# Altium project PCB_Project_sch_layout.PrjPcb (part 1 of 2)
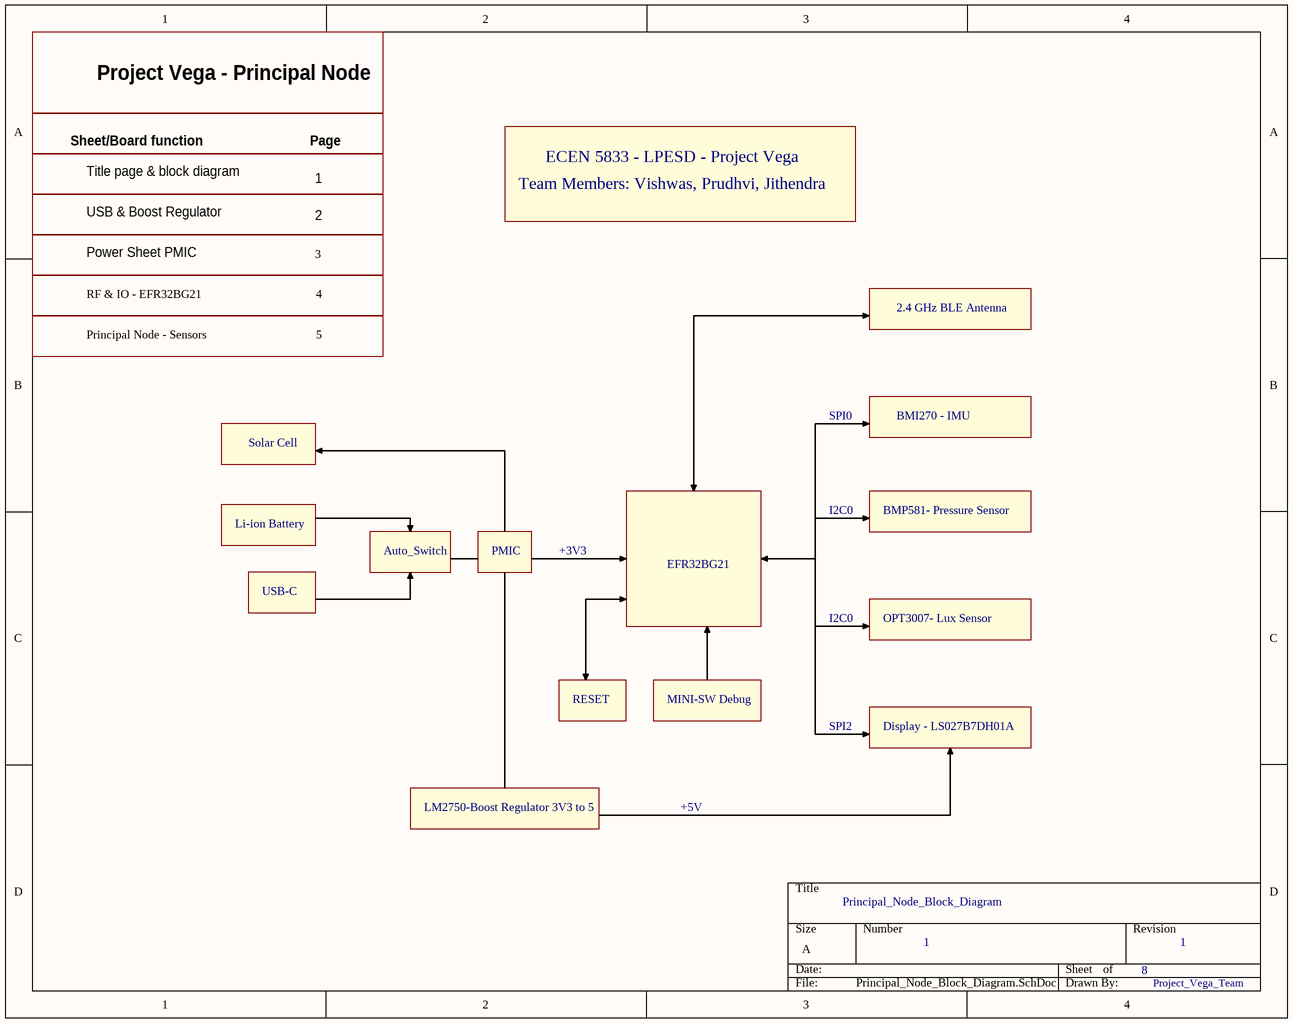
[diagram p0: Principal_Node_Block_Diagram.SchDoc]
8 sheets, 154 parts. Net scope: flat (ports and power ports of the same name join across sheets).
Board file: PCB_Vega.PcbDoc
Sheets:
  Principal_Node_Block_Diagram.SchDoc
  Input_power.SchDoc
  Power_Sheet.SchDoc
  Principal_Node.SchDoc
  Project_Node_Sensors.SchDoc
  Client_Node_Block_Diagram.SchDoc
  Client_Node_1.SchDoc
  Client_Node_2.SchDoc

## Sheet Principal_Node_Block_Diagram.SchDoc: Principal_Node_Block_Diagram
size A; DrawnBy: Project_Vega_Team; Revision: 1; SheetNumber: 1; SheetTotal: 8

### Notes on the sheet
- Project Vega - Principal Node
- Sheet/Board function
- Page
- ECEN 5833 - LPESD - Project Vega
- Title page & block diagram
- USB & Boost Regulator
- 1
- 2
- Team Members: Vishwas, Prudhvi, Jithendra
- Power Sheet PMIC
- RF & IO - EFR32BG21
- 3
- 4
- Principal Node - Sensors
- 5
- 2.4 GHz BLE Antenna
- SPI0
- BMI270 - IMU
- Solar Cell
- Li-ion Battery
- Auto_Switch
- PMIC
- +3V3
- EFR32BG21
- I2C0
- BMP581- Pressure Sensor
- USB-C
- OPT3007- Lux Sensor
- RESET
- MINI-SW Debug
- SPI2
- Display - LS027B7DH01A
- LM2750-Boost Regulator 3V3 to 5
- +5V

## Sheet Input_power.SchDoc: Input_Power
size A4; DrawnBy: Project_Vega_Team; Revision: 1; SheetNumber: 2; SheetTotal: 7
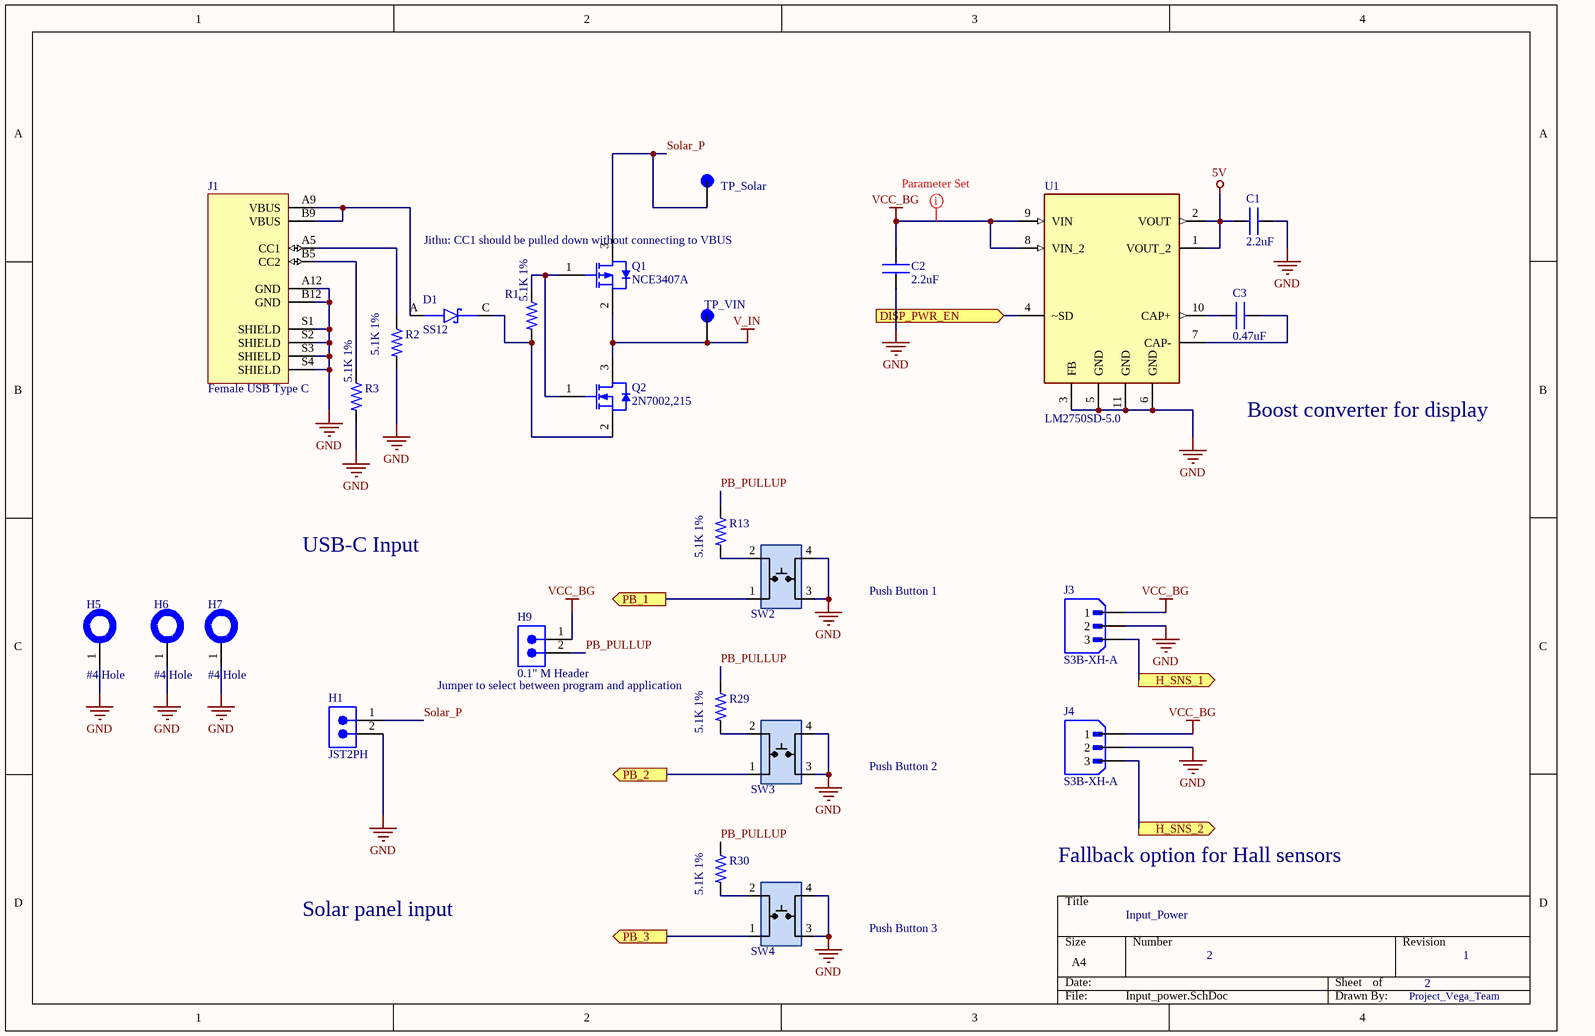
[diagram p1: Input_power.SchDoc]

### Parts
C1  2.2uF  [CAP_0603_1MM]
C2  2.2uF  [CAP_0603_1MM]
C3  0.47uF  [CAP_0603_1MM]
D1  SS12  [DIOM4427X270N]
H1  JST2PH  [JST_B2B-PH-K-S(LF)(SN)]
H5  #4 Hole  [HOLE_#4]  (no BOM)
H6  #4 Hole  [HOLE_#4]  (no BOM)
H7  #4 Hole  [HOLE_#4]  (no BOM)
H9  0.1" M Header  [2-PIN_MALE_HEADER_01-IN]
J1  Female USB Type C  [GCT_USB4125-GF-A_REVA2]
J3  S3B-XH-A  [JST_S3B-XH-A]
J4  S3B-XH-A  [JST_S3B-XH-A]
Q1  NCE3407A  [NCEP-SOT23-3_M]
Q2  2N7002,215  [NXP-SOT23-3_V]
R1  5.1K 1%  [RES_0603_1608X06]
R2  5.1K 1%  [RES_0603_1608X06]
R3  5.1K 1%  [RES_0603_1608X06]
R13  5.1K 1%  [RES_0603]
R29  5.1K 1%  [RES_0603]
R30  5.1K 1%  [RES_0603]
SW2  TL3305AF160QG  [Switch_JLC]  (value not drawn)
SW3  TL3305AF160QG  [Switch_JLC]  (value not drawn)
SW4  TL3305AF160QG  [Switch_JLC]  (value not drawn)
TP_Solar  Test_point  [1]  (value not drawn)
TP_VIN  Test_point  [1]  (value not drawn)
U1  LM2750SD-5.0  [LM2750_DFN300X300X80-11N]

### Ports
DISP_PWR_EN (in, see Principal_Node[2D]), H_SNS_1 (out, see Principal_Node[2D]), H_SNS_2 (out, see Principal_Node[2D]), PB_1 (out, see Principal_Node[2C]), PB_2 (out, see Principal_Node[2C]), PB_3 (out, see Principal_Node[2D])

### Nets
5V: C1.2 U1.1(VOUT_2) U1.2(VOUT)
GND: C1.1 C2.1 H1.2 H5.1 H6.1 H7.1 J1.A12(GND) J1.B12(GND) J1.S1(SHIELD) J1.S2(SHIELD) J1.S3(SHIELD) J1.S4(SHIELD) J3.2 J4.2 R2.2 R3.2 SW2.3 SW2.4 SW3.3 SW3.4 SW4.3 SW4.4 U1.3(FB) U1.5(GND) U1.6(GND) U1.11(GND)
V_IN: Q1.2(SOURCE) Q2.3(D) TP_VIN.TP(VIN)
VCC_BG: C2.2 H9.1 J3.1 J4.1 U1.8(VIN_2) U1.9(VIN)
PB_PULLUP: H9.2 R13.1 R29.1 R30.1
Solar_P: H1.1 Q1.3(DRAIN) TP_Solar.TP(Solar)
NetC3_1: C3.1 U1.7(CAP-)
NetC3_2: C3.2 U1.10(CAP+)
NetD1_A: D1.A J1.A9(VBUS) J1.B9(VBUS)
NetD1_C: D1.C Q2.2(S) R1.2
NetJ1_A5: J1.A5(CC1) R2.1
NetJ1_B5: J1.B5(CC2) R3.1
NetJ3_3: J3.3 ; port H_SNS_1
NetJ4_3: J4.3 ; port H_SNS_2
NetQ1_1: Q1.1(GATE) Q2.1(G) R1.1
NetR13_2: R13.2 SW2.2
NetR29_2: R29.2 SW3.2
NetR30_2: R30.2 SW4.2
NetR33_2: SW3.1 ; port PB_2
NetR36_2: SW2.1 ; port PB_1
NetSW4_1: SW4.1 ; port PB_3
NetU1_4: U1.4(~SD) ; port DISP_PWR_EN

### Layout directives
rule Width Constraint [Pref Width = 20mil    Min Width = 6mil    Max Width = 20mil]: VCC_BG

### Notes on the sheet
- (near Q1) Jithu: CC1 should be pulled down without connecting to VBUS
- Boost converter for display
- USB-C Input
- Push Button 1
- (near R29) Jumper to select between program and application
- Push Button 2
- Solar panel input
- Fallback option for Hall sensors
- Push Button 3

### Library data of the parts
C1 = GRM188R61A226ME15D: Manufacturer: Murata; Capacitance: 22 uF; Voltage Rating DC: 10 VDC; Dielectric: X5R; Tolerance: 20 %; Brand: Murata Electronics; Type: Voltage and Temperature Derating Recommended Product; Unit Weight: 0.000222 oz; Supplier 1: Digi-Key; Supplier Part Number 1: 490-10476-1-ND; Manufacturer Part Number: GRM188R61A226ME15D; Stock 1: 849458; Pricing 1: 1=0.33, 10=0.226, 50=0.1506, 100=0.1279, 500=0.0903, 1000=0.079 (USD); Product Category: Multilayer Ceramic Capacitors MLCC - SMD/SMT; RoHS: True; Case Code - in: 0603; Case Code - mm: 1608; Height: 0.8 mm; Maximum Operating Temperature: + 85 C; Minimum Operating Temperature: - 55 C; Product: General Type MLCCs; Series: GRM; Packaging: Reel; Length: 1.6 mm; Package / Case: 0603 (1608 metric); Factory Pack Quantity: 4000; Termination Style: SMD/SMT; Width: 0.8 mm; ComponentLink1URL: http://www.farnell.com/datasheets/2047978.pdf?src-supplier=Element14; ComponentLink1Description: http://www.farnell.com/datasheets/2047978.pdf?src-supplier=Element14
C2 C3 = GRM188R61A226ME15D: CAP CER 22UF 10V X5R 0603; Manufacturer: Murata; Voltage Rating DC: 10 VDC; Tolerance: 20 %; Brand: Murata Electronics; Type: Voltage and Temperature Derating Recommended Product; Unit Weight: 0.000222 oz; Supplier 1: Digi-Key; Supplier Part Number 1: 490-10476-1-ND; Manufacturer Part Number: GRM188R61A226ME15D; Stock 1: 849458; Pricing 1: 1=0.33, 10=0.226, 50=0.1506, 100=0.1279, 500=0.0903, 1000=0.079 (USD); Product Category: Multilayer Ceramic Capacitors MLCC - SMD/SMT; RoHS: True; Capacitance: 22 uF; Dielectric: X5R; Case Code - in: 0603; Case Code - mm: 1608; Height: 0.8 mm; Maximum Operating Temperature: + 85 C; Minimum Operating Temperature: - 55 C; Product: General Type MLCCs; Series: GRM; Packaging: Reel; Length: 1.6 mm; Package / Case: 0603 (1608 metric); Factory Pack Quantity: 4000; Termination Style: SMD/SMT; Width: 0.8 mm; ComponentLink1URL: http://www.farnell.com/datasheets/2047978.pdf?src-supplier=Element14; ComponentLink1Description: http://www.farnell.com/datasheets/2047978.pdf?src-supplier=Element14
D1 = SS12: DIODE SCHOTTKY 20V 1A DO214AC; MF: Klein Tools,; SnapEDA_Link: https://www.snapeda.com/parts/SS12/Klein%20Tools,%20Inc./view-part/2177644/?ref=snap; MP: SS12; Check_prices: https://www.snapeda.com/parts/SS12/Klein%20Tools,%20Inc./view-part/2177644/?ref=eda; Price: None; Purchase-URL: https://pricing.snapeda.com/search/part/SS12/?ref=eda; Value: *; Availability: Good; Package: DO-214AC-214 ON Semiconductor; ComponentLink1Description: digikey; ComponentLink1URL: https://www.digikey.com/en/products/detail/onsemi/SS12/1049858
H1 = JST2PH: Connector Header Through Hole 2 position 0.079" (2.00mm); Manufacturer: JST; Manufacturer Part Number: B2B-PH-K-S; Supplier: Digi-Key; Supplier Part Number: 455-1704-ND; RoHS: Yes; Category: Connectors; Stock: 1077617; Pricing: 1=0.19, 10=0.147, 100=0.1088, 500=0.09006, 1000=0.0788, 5000=0.06754, 10000=0.06567 (USD); ComponentLink1URL: https://datasheet.ciiva.com/6905/phseries-6905929.pdf?src-supplier=Digi-Key; ComponentLink1Description: https://datasheet.ciiva.com/6905/phseries-6905929.pdf?src-supplier=Digi-Key
H5-H7 = HOLE_#4
H9 = PRPC002SAAN-RC: CONN HEADER VERT 2POS 2.54MM; Manufacturer: Sullins; Connector Type: Header, Unshrouded, Breakaway; Number of Positions: 2; Number of Positions Loaded: All; Pitch: 0.100" (2.54mm); Online Catalog: 0.100" (2.54mm) Pitch Connector Headers; Other Names: S9510E-02  S9510E-02-ND; Supplier 1: Digi-Key; Manufacturer Part Number: PRPC002SAAN-RC; Stock 1: 42739; Pricing 1: 1=0.08, 10=0.073, 25=0.054, 50=0.0464, 100=0.0449, 250=0.0387, 500=0.0372 (USD); Standard Package: 1; Category: Connectors, Interconnects; Family: Rectangular Connectors - Headers, Male Pins; Series: -; Packaging: Bulk; Contact Type: Male Pin; Number of Rows: 1; Row Spacing: -; Contact Mating Length: 0.230" (5.84mm); Mounting Type: Through Hole; Termination: Solder; Fastening Type: -; Features: -; Contact Finish: Gold; Contact Finish Thickness: Flash; Color: Black; ComponentLink1URL: https://media.digikey.com/PDF/Data%20Sheets/Sullins%20PDFs/xRxCzzzSxxN-RC_ST_11635-B.pdf?src-supplier=Digi-Key; ComponentLink1Description: https://media.digikey.com/PDF/Data%20Sheets/Sullins%20PDFs/xRxCzzzSxxN-RC_ST_11635-B.pdf?src-supplier=Digi-Key; Supplier Part Number 1: S1011EC-02-ND
J1 = USB-C Power Connector: USB Connector, 24 Contact(s), Female, Right Angle, Solder Terminal, Locking, Receptacle; Manufacturer Part Number: USB4125-GF-A_REVA2; Manufacturer: Global Connector Technology; Package: None; Availability: Unavailable; Value: *; Price: None; Supplier: Digikey; Supplier Part Number: 2073-USB4125-GF-ACT-ND; RoHS: No; Category: Connectors; Stock: 9026; Pricing: 1=0.8, 10=0.609, 25=0.5472, 50=0.505, 100=0.4667, 250=0.42128, 500=0.3905, 1000=0.36254, 2000=0.3372, 3000=0.32348, 5000=0.3073, 7000=0.29727, 10000=0.28716, 25000=0.2675 (USD); Pins: 6; Gender: Receptacle; Orientation: Horizontal; ComponentLink1URL: https://datasheet.octopart.com/USB4125-GF-A-Global-Connector-Technology-datasheet-148864632.pdf?src-supplier=Future+Electronics; ComponentLink1Description: https://datasheet.octopart.com/USB4125-GF-A-Global-Connector-Technology-datasheet-148864632.pdf?src-supplier=Future+Electronics; ComponentLink2URL: https://datasheet.octopart.com/USB4125-GF-A-GCT-datasheet-166929326.pdf?src-supplier=SOS+electronic; ComponentLink2Description: https://datasheet.octopart.com/USB4125-GF-A-GCT-datasheet-166929326.pdf?src-supplier=SOS+electronic
J3 J4 = S3B-XH-A: Board Connector, 3 Contact(s), 1 Row(s), Male, Right Angle, Solder Terminal; Manufacturer: JST; MF: JST Sales; MP: B3B-XH-A(LF)(SN); Number of Contacts: 3; SnapEDA_Link: https://www.snapeda.com/parts/B3B-XH-A(LF)(SN)/JST+Sales+America+Inc./view-part/?ref=snap; Package: None; Value: *; Check_prices: https://www.snapeda.com/parts/B3B-XH-A(LF)(SN)/JST+Sales+America+Inc./view-part/?ref=eda; Supplier 1: Digikey; Supplier Part Number 1: 455-S3B-XH-A-ND; Supplier: Digikey; Supplier Part Number: 455-S3B-XH-A-ND; Manufacturer Part Number: S3B-XH-A; RoHS: Yes; Category: FFC / FPC; Stock: 168930; Pricing: 1=0.19, 10=0.146, 100=0.1118, 500=0.09304, 1000=0.08614, 5000=0.07248, 10000=0.06971 (USD); Contact Plating: Tin; Contact Material: Brass; Number of Rows: 1; Termination: Through Hole; Gender: Male; Series: XH; Reach SVHC Compliant: No; ComponentLink1URL: https://datasheet.ciiva.com/8052/621903-8052222.pdf?src-supplier=Element14; ComponentLink1Description: https://datasheet.ciiva.com/8052/621903-8052222.pdf?src-supplier=Element14
Q1 = CMP-013-00018-3: P-Channel Enhancement Mode Power MOSFET, 30 V, 4.3 A, - 55 to 150 degC, 3-Pin SOT23, RoHS, Tape and Reel; Manufacturer: NCE Power; Datasheet Version: Rev. 1.1, 07/2014; Case/Package: SOT23-3; Mounting Technology: SM; Datasheet URL: http://www.ncepower.com/Upload/MOSFET/mos1/55vpmos/NCE3407Adatasheet-17275285683.pdf; Package Reference: SOT23-3; Package Description: 3-Pin Small Outline Transistor, Body 2.9 x 1.3 mm, Pitch 0.95 mm; RoHS Compliant: Unknown
Q2 = CMP-013-00011-4: N-channel Trench MOSFET, 60 V, 300 mA, -65 to 150 degC, 3-Pin SOT-23 (TO-236AB), RoHS, Tape and Reel; Manufacturer: NXP Semiconductors; Elements: 1; Power: 830mW; Max Dual Supply Voltage: 60V; Rds On Max: 5Ohm; Package Version: Feb-16; Nominal Vgs: 2V; Input Capacitance: 50pF; RoHS Compliant: True; Datasheet URL: http://www.nxp.com/documents/data_sheet/2N7002.pdf; Packaging: TapeandReel; Case/Package: TO-236-3; Package Reference: SOT23-3; Max Operating Temperature: 150°C; Pins: 8; Mounting Technology: SM; Package Quantity: 1; Datasheet Version: Rev. 7, 09/2011; Nominal Dual Supply Voltage: 60V; Min Operating Temperature: -65°C; Package Description: 3-Pin Small Outline Transistor, Body 1.3 x 2.9 mm, Pitch 0.95 mm; Vds Max: 60V
R1 R3 R13 R29 R30 = RC0603FR-07316KL: SMD Chip Resistor, 5.1KOhm, ± 1%, 100 mW, 0603 [1608 Metric], Thick Film, General Purpose; Manufacturer: Yageo; Value: 316kR; Power Rating: 100mW; Voltage Rating: 50V; Temperature Coefficient: 100ppm/°C; Supplier: Digikey; Supplier Part Number: 311-316KHRCT-ND; Manufacturer Part Number: RC0603FR-07316KL; RoHS: Yes; Category: Chip SMD Resistors; Stock: 149463; Pricing: 1=0.1, 10=0.019, 50=0.0112, 100=0.0093, 500=0.00622, 1000=0.00532 (USD); Mounting Technology: Surface Mount; Case/Package: 0603; Case Code (Imperial): 0603; Case Code (Metric): 1608; Min Operating Temperature: -55°C; Max Operating Temperature: 155°C; Tolerance: 1%; Packaging: Tape and Reel; Termination: SMD/SMT; Number of Terminations: 2; Max Power Dissipation: 100mW; Voltage Rating (DC): 50V; Features: Moisture Resistant; Series: RC; Lead Free: Lead Free; RoHS Compliant: Yes; ComponentLink1URL: https://datasheet.ciiva.com/2454/pyu-r-int-thick-7-2454966.pdf?src-supplier=Digikey; ComponentLink1Description: https://datasheet.ciiva.com/2454/pyu-r-int-thick-7-2454966.pdf?src-supplier=Digikey; ComponentLink2URL: https://datasheet.ciiva.com/2454/pyu-r-int-thick-7-2454967.pdf?src-supplier=Digikey; ComponentLink2Description: https://datasheet.ciiva.com/2454/pyu-r-int-thick-7-2454967.pdf?src-supplier=Digikey; ComponentLink3URL: https://datasheet.ciiva.com/2454/pyu-r-int-thick-7-2454968.pdf?src-supplier=Digikey; ComponentLink3Description: https://datasheet.ciiva.com/2454/pyu-r-int-thick-7-2454968.pdf?src-supplier=Digikey
R2 = RC0603FR-07316KL: SMD Chip Resistor, 316 kOhm, ± 1%, 100 mW, 0603 [1608 Metric], Thick Film, General Purpose; Manufacturer: Yageo; Value: 316kR; Power Rating: 100mW; Voltage Rating: 50V; Temperature Coefficient: 100ppm/°C; Supplier: Digikey; Supplier Part Number: 311-316KHRCT-ND; Manufacturer Part Number: RC0603FR-07316KL; RoHS: Yes; Category: Chip SMD Resistors; Stock: 149463; Pricing: 1=0.1, 10=0.019, 50=0.0112, 100=0.0093, 500=0.00622, 1000=0.00532 (USD); Mounting Technology: Surface Mount; Case/Package: 0603; Case Code (Imperial): 0603; Case Code (Metric): 1608; Min Operating Temperature: -55°C; Max Operating Temperature: 155°C; Tolerance: 1%; Packaging: Tape and Reel; Termination: SMD/SMT; Number of Terminations: 2; Max Power Dissipation: 100mW; Voltage Rating (DC): 50V; Features: Moisture Resistant; Series: RC; Lead Free: Lead Free; RoHS Compliant: Yes; ComponentLink1URL: https://datasheet.ciiva.com/2454/pyu-r-int-thick-7-2454966.pdf?src-supplier=Digikey; ComponentLink1Description: https://datasheet.ciiva.com/2454/pyu-r-int-thick-7-2454966.pdf?src-supplier=Digikey; ComponentLink2URL: https://datasheet.ciiva.com/2454/pyu-r-int-thick-7-2454967.pdf?src-supplier=Digikey; ComponentLink2Description: https://datasheet.ciiva.com/2454/pyu-r-int-thick-7-2454967.pdf?src-supplier=Digikey; ComponentLink3URL: https://datasheet.ciiva.com/2454/pyu-r-int-thick-7-2454968.pdf?src-supplier=Digikey; ComponentLink3Description: https://datasheet.ciiva.com/2454/pyu-r-int-thick-7-2454968.pdf?src-supplier=Digikey
SW2-SW4 = SW_Push_Button_JLC: Tactile Switch SPST-NO Top Actuated Surface Mount; MFR Part #: KH-4.5X4.5X4.3H-STM; LCSC Part#: C2837550; Type: Extended; DataSheet: https://datasheet.lcsc.com/lcsc/2106081532_Shenzhen-Kinghelm-Elec-KH-4.5X4.5X4.3H-STM_C2837550.pdf
TP_Solar TP_VIN = Test_point: SMT Test Point- Mininature-1000 pc Reels; MP: 5019; MF: Keystone Electronics; Value: *; Availability: In Stock; Purchase-URL: https://pricing.snapeda.com/search/part/5019/?ref=eda; Package: None; Price: None
U1 = LM2750SD-5.0: Voltage Regulators - Switching Regulators Reg Switch Capacitor Boost Reg; Manufacturer: TI National Semiconductor; Manufacturer Part Number: LM2750SD-5.0/NOPB; MP: LM2750SD-5-0; Output Voltage: 5V; Number of Outputs: 1; Output Current: 120mA; Frequency: 1.7MHz; Max Supply Voltage: 5.6V; Min Supply Voltage: 2.7V; Efficiency: 87%; Operating Supply Current: 5mA; Min Output Voltage: 4.8V; Output Type: Fixed; Package: None; Price: None; Value: *; Availability: Unavailable; Supplier 1: Digikey; Supplier Part Number 1: LM2750SD-5.0/NOPBCT-ND; Supplier: Digikey; Supplier Part Number: LM2750SD-5.0/NOPBCT-ND; RoHS: Yes; Category: Voltage Regulators - Switching; Stock: 1468; Pricing: 1=2.34, 10=1.674, 25=1.5068, 100=1.3227, 250=1.23504, 500=1.18214 (USD); Mounting Technology: Surface Mount; Pins: 10; Min Operating Temperature: -40°C; Max Operating Temperature: 85°C; Packaging: Tape and Reel; Max Output current: 120mA; Min Input Voltage: 2.7V; Switching Frequency: 1.7MHz; Nominal Output Voltage: 5V; Max Output Voltage: 5V; Termination: SMD/SMT; Quiescent Current: 5mA; Topology: Boost; Series: LM2750; Length: 3mm; Width: 3mm; Height: 0.8mm; Thickness: 750um; Radiation Hardening: No; Reach SVHC Compliant: No; Lead Free: Lead Free; RoHS Compliant: Yes; ComponentLink1URL: https://datasheet.ciiva.com/5699/1781827-5699312.pdf?src-supplier=Farnell; ComponentLink1Description: https://datasheet.ciiva.com/5699/1781827-5699312.pdf?src-supplier=Farnell; ComponentLink2URL: https://datasheet.ciiva.com/6598/lm2750-6598374.pdf?src-supplier=Digikey; ComponentLink2Description: https://datasheet.ciiva.com/6598/lm2750-6598374.pdf?src-supplier=Digikey; ComponentLink3URL: https://datasheet.ciiva.com/7994/59930-7994364.pdf?src-supplier=Element14; ComponentLink3Description: https://datasheet.ciiva.com/7994/59930-7994364.pdf?src-supplier=Element14

## Sheet Power_Sheet.SchDoc: Power Sheet
size A4; DrawnBy: Project_Vega_Team; Revision: 1; SheetNumber: 3; SheetTotal: 7
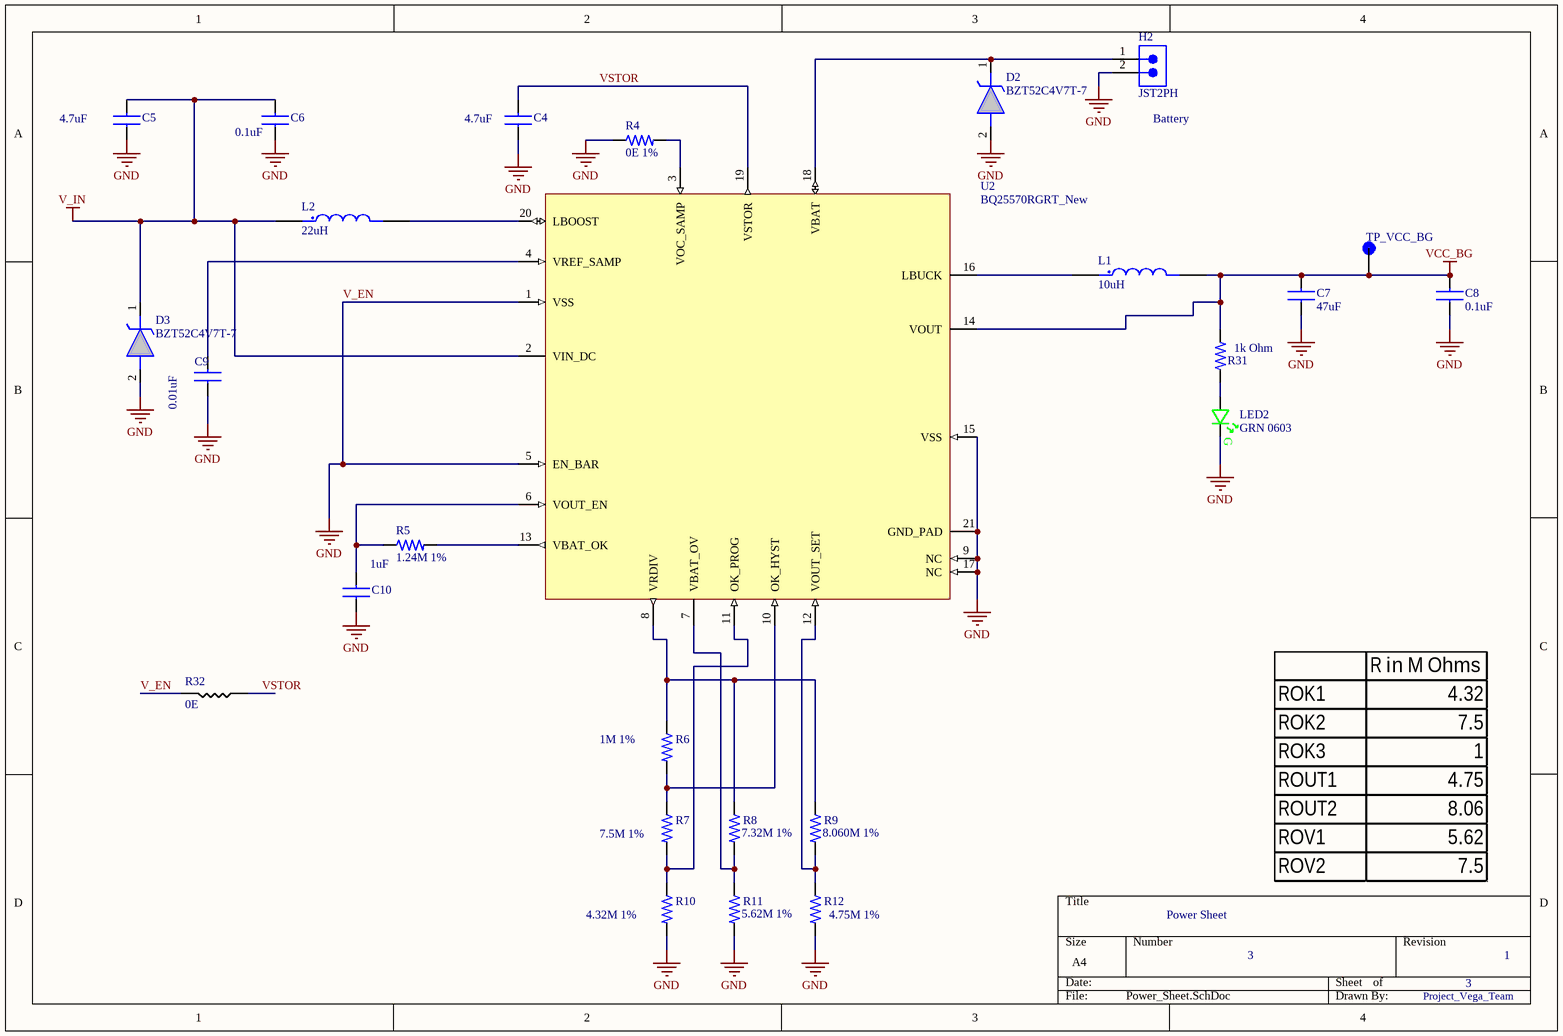
[diagram p2: Power_Sheet.SchDoc]

### Parts
C4  4.7uF  [CAP_0603_1MM]
C5  4.7uF  [CAP_0603_1MM]
C6  0.1uF  [CAP_0603_1MM]
C7  47uF  [CAP_0603_1MM]
C8  0.1uF  [CAP_0603_1MM]
C9  0.01uF  [CAP_0603_1MM]
C10  1uF  [CAP_0603_1MM]
D2  BZT52C4V7T-7  [SOD3715X135N]
D3  BZT52C4V7T-7  [SOD3715X135N]
H2  JST2PH  [JST_B2B-PH-K-S(LF)(SN)]
L1  10uH  [IND_LPS4018-103MRB]
L2  22uH  [IND_LPS4018-223MRC]
LED2  GRN 0603  [LED_0603_GRN_WL-SMCW]
R4  0E 1%  [RES_0603_1608X06]
R5  1.24M 1%  [RES_0603_1608X06]
R6  1M 1%  [RES_0603_1608X06]
R7  7.5M 1%  [RES_0603_1608X06]
R8  7.32M 1%  [RES_0603_1608X06]
R9  8.060M 1%  [RES_0603_1608X06]
R10  4.32M 1%  [RES_0603_1608X06]
R11  5.62M 1%  [RES_0603_1608X06]
R12  4.75M 1%  [RES_0603_1608X06]
R31  1k Ohm  [RES_0603]
R32  value 0E  [1206_Passive_Resitor]  (hidden comment: 10k)
TP_VCC_BG  Test_point  [1]  (value not drawn)
U2  BQ25570RGRT_New  [QFN50P350X350X100-21N - duplicate]

### Nets
GND: C4.1 C5.1 C6.1 C7.1 C8.1 C9.1 C10.1 D2.2(A) D3.2(A) H2.2 LED2.C R4.1 R10.2 R11.2 R12.2 R32.2 U2.1(VSS) U2.5(EN_BAR) U2.9(NC) U2.15(VSS) U2.17(NC) U2.21(GND_PAD)  [also labelled V_EN]
V_IN: C5.2 C6.2 D3.1(K) L2.1 U2.2(VIN_DC)
VCC_BG: C7.2 C8.2 L1.2 R31.2 TP_VCC_BG.TP(VCC_BG) U2.14(VOUT)
VSTOR: C4.2 R32.1 U2.19(VSTOR)
NetC9_2: C9.2 U2.4(VREF_SAMP)
NetC10_2: C10.2 R5.1 U2.6(VOUT_EN)
NetD2_1: D2.1(K) H2.1 U2.18(VBAT)
NetL1_1: L1.1 U2.16(LBUCK)
NetL2_2: L2.2 U2.20(LBOOST)
NetLED2_A: LED2.A R31.1
NetR4_2: R4.2 U2.3(VOC_SAMP)
NetR5_2: R5.2 U2.13(VBAT_OK)
NetR6_1: R6.1 R8.1 R9.1 U2.8(VRDIV)
NetR6_2: R6.2 R7.1 U2.10(OK_HYST)
NetR7_2: R7.2 R10.1 U2.11(OK_PROG)
NetR8_2: R8.2 R11.1 U2.7(VBAT_OV)
NetR9_2: R9.2 R12.1 U2.12(VOUT_SET)

### Notes on the sheet
- (near H2) Battery
- (in symbol LED_green) G

### Library data of the parts
C4-C10 = GRM188R61A226ME15D: as C2 on sheet Input_power; Supplier 1: Digi-Key; Supplier Part Number 1: 490-10476-1-ND; Manufacturer Part Number: GRM188R61A226ME15D; Stock 1: 849458; Pricing 1: 1=0.33, 10=0.226, 50=0.1506, 100=0.1279, 500=0.0903, 1000=0.079 (USD); Product Category: Multilayer Ceramic Capacitors MLCC - SMD/SMT; RoHS: True; Capacitance: 22 uF; Dielectric: X5R; Case Code - in: 0603; Case Code - mm: 1608; Height: 0.8 mm; Maximum Operating Temperature: + 85 C; Minimum Operating Temperature: - 55 C; Product: General Type MLCCs; Series: GRM; Packaging: Reel; Length: 1.6 mm; Package / Case: 0603 (1608 metric); Factory Pack Quantity: 4000; Termination Style: SMD/SMT; Width: 0.8 mm; ComponentLink1URL: http://www.farnell.com/datasheets/2047978.pdf?src-supplier=Element14; ComponentLink1Description: http://www.farnell.com/datasheets/2047978.pdf?src-supplier=Element14
D2 D3 = BZT52C4V7T-7: Diode Zener Single 4.7V 6% 300mW 2-Pin SOD-523 T/R; Manufacturer_Name: Diodes Incorporated; Manufacturer: Diodes; Geometry.Height: 0.65mm; Impedance: 80R; Max Reverse Leakage Current: 3uA; Zener Current: 5mA; ESD Protection: No; Mouser Part Number: 621-BZT52C4V7T-7; Mouser Price/Stock: https://www.mouser.co.uk/ProductDetail/Diodes-Incorporated/BZT52C4V7T-7?qs=zLeapIUCO8SroLebLeUNYA%3D%3D; Manufacturer_Part_Number: BZT52C4V7T-7; Datasheet Link: https://www.diodes.com//assets/Datasheets/ds30502.pdf; Supplier: Digikey; Supplier Part Number: BZT52C4V7T-7DICT-ND; Manufacturer Part Number: BZT52C4V7T-7; RoHS: Yes; Category: Zener Diodes; Stock: 25726; Pricing: 1=0.12, 10=0.08, 100=0.0538, 500=0.0408, 1000=0.03639 (USD); Mounting Technology: Surface Mount; Pins: 2; Weight: 3.5E-05oz; Contact Plating: Tin,Matte; Min Operating Temperature: -65°C; Max Operating Temperature: 150°C; Packaging: Tape and Reel; Package Quantity: 3000; Tolerance: 6%; Max Power Dissipation: 300mW; Zener Voltage: 4.7V; Power Dissipation: 300mW; Voltage Tolerance: 6%; Test Current: 5mA; Termination: SMD/SMT; Max Reverse Current: 3uA; Power Rating: 300mW; Series: -; Length: 1.3mm; Width: 0.9mm; Height: 0.7mm; RoHS Compliant: Yes; ComponentLink1URL: https://datasheet.ciiva.com/25623/0900766b8104c33b-25623740.pdf?src-supplier=Rs; ComponentLink1Description: https://datasheet.ciiva.com/25623/0900766b8104c33b-25623740.pdf?src-supplier=Rs; ComponentLink2URL: https://datasheet.ciiva.com/4734/ds30502-85251-4734173.pdf?src-supplier=Mouser; ComponentLink2Description: https://datasheet.ciiva.com/4734/ds30502-85251-4734173.pdf?src-supplier=Mouser
H2 = JST2PH: as H1 on sheet Input_power; Supplier: Digi-Key; Supplier Part Number: 455-1704-ND; RoHS: Yes; Category: Connectors; Stock: 1077617; Pricing: 1=0.19, 10=0.147, 100=0.1088, 500=0.09006, 1000=0.0788, 5000=0.06754, 10000=0.06567 (USD); ComponentLink1URL: https://datasheet.ciiva.com/6905/phseries-6905929.pdf?src-supplier=Digi-Key; ComponentLink1Description: https://datasheet.ciiva.com/6905/phseries-6905929.pdf?src-supplier=Digi-Key
L1 = LPS4018-103MRB: Power inductor, shielded, 20/30% tol, SMT, RoHS, lead-free, halogen-free; MF: Coilcraft; SnapEDA_Link: https://www.snapeda.com/parts/LPS4018-103MRB/Coilcraft/view-part/?ref=snap; Package: None; Value: *; MP: LPS4018-103MRB; Check_prices: https://www.snapeda.com/parts/LPS4018-103MRB/Coilcraft/view-part/?ref=eda
L2 = LPS4018-223MRC: 22 µH Shielded Drum Core Inductor 650 mA 360mOhm Max Nonstandard; MF: Coilcraft; SnapEDA_Link: https://www.snapeda.com/parts/LPS4018-223MRC/Coilcraft/view-part/?ref=snap; Package: None; Value: *; MP: LPS4018-223MRC; Check_prices: https://www.snapeda.com/parts/LPS4018-223MRC/Coilcraft/view-part/?ref=eda
LED2 = LED_green: 430mcd Colorless transparence 520nm Emerald 140° LED0603 Light Emitting Diodes (LED) ROHS; Manufacturer: Wurth Electronics; Manufacturer Part Number: 150060GS75000; Dynamic Catalog: 0603 Rectangle with Flat Top Chip LEDs; 3D Model: SMCW_0603.igs / SMCW_0603.stp / SMCW_0603.wrl; Color: Green; Wavelength - Peak: 515nm; Voltage - Forward (Vf) (Typ): 3.2V; Current - Test: 20mA; Lens Type: Clear; Lens Style/Size: Rectangle with Flat Top, 1.1mm x 0.7mm; Other Names: 732-4971-2; Lens Style: Clear,Flat,Rectangular; Forward Current: 30mA; Max Reverse Voltage (DC): 5V; Output Current: 10uA; Power Dissipation: 105mW; Lens Size: 0.7mm; Supplier 1: Digi-Key; Stock 1: 34964; Pricing 1: 1=0.14, 50=0.129, 100=0.11, 500=0.095 (USD); Standard Package: 4,000; Category: Optoelectronics; Family: LED Indication - Discrete; Series: WL-SMCW; Packaging: Tape & Reel (TR); Wavelength - Dominant: 520nm; Millicandela Rating: 430mcd; Viewing Angle: 140°; Package / Case: 0603 (1608 Metric); Size / Dimension: 1.60mm L x 0.80mm W; Height: 0.70mm; Mounting Type: Surface Mount; Online Catalog: 0603 Rectangle with Flat Top Chip LEDs; ComponentLink1URL: https://katalog.we-online.de/led/datasheet/150060GS75000.pdf?src-supplier=Digi-Key; ComponentLink1Description: https://katalog.we-online.de/led/datasheet/150060GS75000.pdf?src-supplier=Digi-Key; ComponentLink2URL: http://www.produktinfo.conrad.com/datenblaetter/750000-774999/759427-da-01-en-CHIPLED_0603_W_KL_GRUEN_150060GS75000.pdf?src-supplier=Conrad; ComponentLink2Description: http://www.produktinfo.conrad.com/datenblaetter/750000-774999/759427-da-01-en-CHIPLED_0603_W_KL_GRUEN_150060GS75000.pdf?src-supplier=Conrad; Supplier Part Number 1: 732-4971-1-ND; Supplier: Digikey; Supplier Part Number: 732-4971-1-ND; RoHS: Yes; Stock: 122246; Pricing: 1=0.15, 50=0.142, 100=0.122, 500=0.105 (USD); Mounting Technology: Surface Mount; Case/Package: 0603; Case Code (Metric): 1608; Case Code (Imperial): 0603; Lens Color: Colorless; Min Operating Temperature: -40°C; Max Operating Temperature: 85°C; Wavelength: 520nm; Package Quantity: 1; Luminous Intensity: 430mcd; Forward Voltage: 3.2V; Dominant Wavelength: 520nm; Test Current: 20mA; Lens Transparency: Clear; Reverse Voltage: 5V; Length: 1.6mm; Width: 0.8mm; Lead Free: Lead Free; RoHS Compliant: Yes; Reach SVHC Compliant: Unknown; ComponentLink3URL: https://datasheet.ciiva.com/29562/150060gs75000-29562868.pdf?src-supplier=Digikey; ComponentLink3Description: https://datasheet.ciiva.com/29562/150060gs75000-29562868.pdf?src-supplier=Digikey; ComponentLink4URL: https://datasheet.ciiva.com/29279/759427-da-01-en-chipled-0603-w-kl-gruen-150060gs75000-29279201.pdf?src-supplier=Conrad; ComponentLink4Description: https://datasheet.ciiva.com/29279/759427-da-01-en-chipled-0603-w-kl-gruen-150060gs75000-29279201.pdf?src-supplier=Conrad; ComponentLink5URL: https://datasheet.ciiva.com/29562/150060gs75000-29562869.pdf?src-supplier=Digikey; ComponentLink5Description: https://datasheet.ciiva.com/29562/150060gs75000-29562869.pdf?src-supplier=Digikey; ComponentLink6URL: https://datasheet.ciiva.com/29562/150060gs75000-29562870.pdf?src-supplier=Digikey; ComponentLink6Description: https://datasheet.ciiva.com/29562/150060gs75000-29562870.pdf?src-supplier=Digikey
R4-R12 = RC0603FR-07316KL: as R2 on sheet Input_power; Supplier: Digikey; Supplier Part Number: 311-316KHRCT-ND; Manufacturer Part Number: RC0603FR-07316KL; RoHS: Yes; Category: Chip SMD Resistors; Stock: 149463; Pricing: 1=0.1, 10=0.019, 50=0.0112, 100=0.0093, 500=0.00622, 1000=0.00532 (USD); Mounting Technology: Surface Mount; Case/Package: 0603; Case Code (Imperial): 0603; Case Code (Metric): 1608; Min Operating Temperature: -55°C; Max Operating Temperature: 155°C; Tolerance: 1%; Packaging: Tape and Reel; Termination: SMD/SMT; Number of Terminations: 2; Max Power Dissipation: 100mW; Voltage Rating (DC): 50V; Features: Moisture Resistant; Series: RC; Lead Free: Lead Free; RoHS Compliant: Yes; ComponentLink1URL: https://datasheet.ciiva.com/2454/pyu-r-int-thick-7-2454966.pdf?src-supplier=Digikey; ComponentLink1Description: https://datasheet.ciiva.com/2454/pyu-r-int-thick-7-2454966.pdf?src-supplier=Digikey; ComponentLink2URL: https://datasheet.ciiva.com/2454/pyu-r-int-thick-7-2454967.pdf?src-supplier=Digikey; ComponentLink2Description: https://datasheet.ciiva.com/2454/pyu-r-int-thick-7-2454967.pdf?src-supplier=Digikey; ComponentLink3URL: https://datasheet.ciiva.com/2454/pyu-r-int-thick-7-2454968.pdf?src-supplier=Digikey; ComponentLink3Description: https://datasheet.ciiva.com/2454/pyu-r-int-thick-7-2454968.pdf?src-supplier=Digikey
R31 = RES_0603: Thick film general purpose resistor 0603; MP: RC0603JR-070RL; Availability: Unavailable; Package: None; Value: *; Price: None
R32 = R_10KOhm_1206: 10 kOhms ±5% 0.25W, 1/4W Chip Resistor 1206 (3216 Metric) Automotive AEC-Q200 Thick Film; MFR Part #: RMCF1206FT10K0; Digikey Link: https://www.digikey.com/en/products/detail/stackpole-electronics-inc/RMCF1206FT10K0/1759669; LCSC Part#: C17902; Type: Basic
TP_VCC_BG = Test_point: as TP_Solar on sheet Input_power; Value: *; Availability: In Stock; Purchase-URL: https://pricing.snapeda.com/search/part/5019/?ref=eda; Package: None; Price: None
U2 = BQ25570RGRT_New: Switching Battery Charger Li-Ion/Li-Pol/Supercapacitor 110mA 2.2V to 5.5V 20-Pin VQFN EP T/R; Manufacturer: Texas Instruments; Output Current: 100mA; Operating Supply Current: 488nA; Min Supply Voltage: 100mV; Max Supply Voltage: 5.1V; Switching Frequency: 1MHz; Supplier: Digikey; Supplier Part Number: 296-37014-1-ND; Manufacturer Part Number: BQ25570RGRT; RoHS: Yes; Category: Battery Management; Stock: 646; Pricing: 1=9.11, 10=6.836, 25=6.2676, 100=5.6427 (USD); Mounting Technology: Surface Mount; Case/Package: VQFN; Pins: 20; Contact Plating: Gold; Min Operating Temperature: -40°C; Max Operating Temperature: 125°C; Packaging: Tape and Reel; Package Quantity: 250; Series: -; Radiation Hardening: No; Reach SVHC Compliant: No; Lead Free: Lead Free; RoHS Compliant: Yes; ComponentLink1URL: https://datasheet.ciiva.com/28483/1768287-28483478.pdf?src-supplier=Element14; ComponentLink1Description: https://datasheet.ciiva.com/28483/1768287-28483478.pdf?src-supplier=Element14; ComponentLink2URL: https://datasheet.ciiva.com/24110/slusbh2c-317150-24110945.pdf?src-supplier=Mouser; ComponentLink2Description: https://datasheet.ciiva.com/24110/slusbh2c-317150-24110945.pdf?src-supplier=Mouser; ComponentLink3URL: https://datasheet.ciiva.com/29590/bq25570-29590197.pdf?src-supplier=Digikey; ComponentLink3Description: https://datasheet.ciiva.com/29590/bq25570-29590197.pdf?src-supplier=Digikey; ComponentLink4URL: https://datasheet.ciiva.com/29590/bq25570-29590198.pdf?src-supplier=Digikey; ComponentLink4Description: https://datasheet.ciiva.com/29590/bq25570-29590198.pdf?src-supplier=Digikey; ComponentLink5URL: https://datasheet.ciiva.com/29892/bq25570-29892856.pdf?src-supplier=Avnet; ComponentLink5Description: https://datasheet.ciiva.com/29892/bq25570-29892856.pdf?src-supplier=Avnet; ComponentLink6URL: https://datasheet.ciiva.com/29892/bq25570-29892857.pdf?src-supplier=Avnet; ComponentLink6Description: https://datasheet.ciiva.com/29892/bq25570-29892857.pdf?src-supplier=Avnet

## Sheet Principal_Node.SchDoc: Principal_Node
size A; DrawnBy: Project_Vega_Team; Revision: 1; SheetNumber: 4; SheetTotal: 8
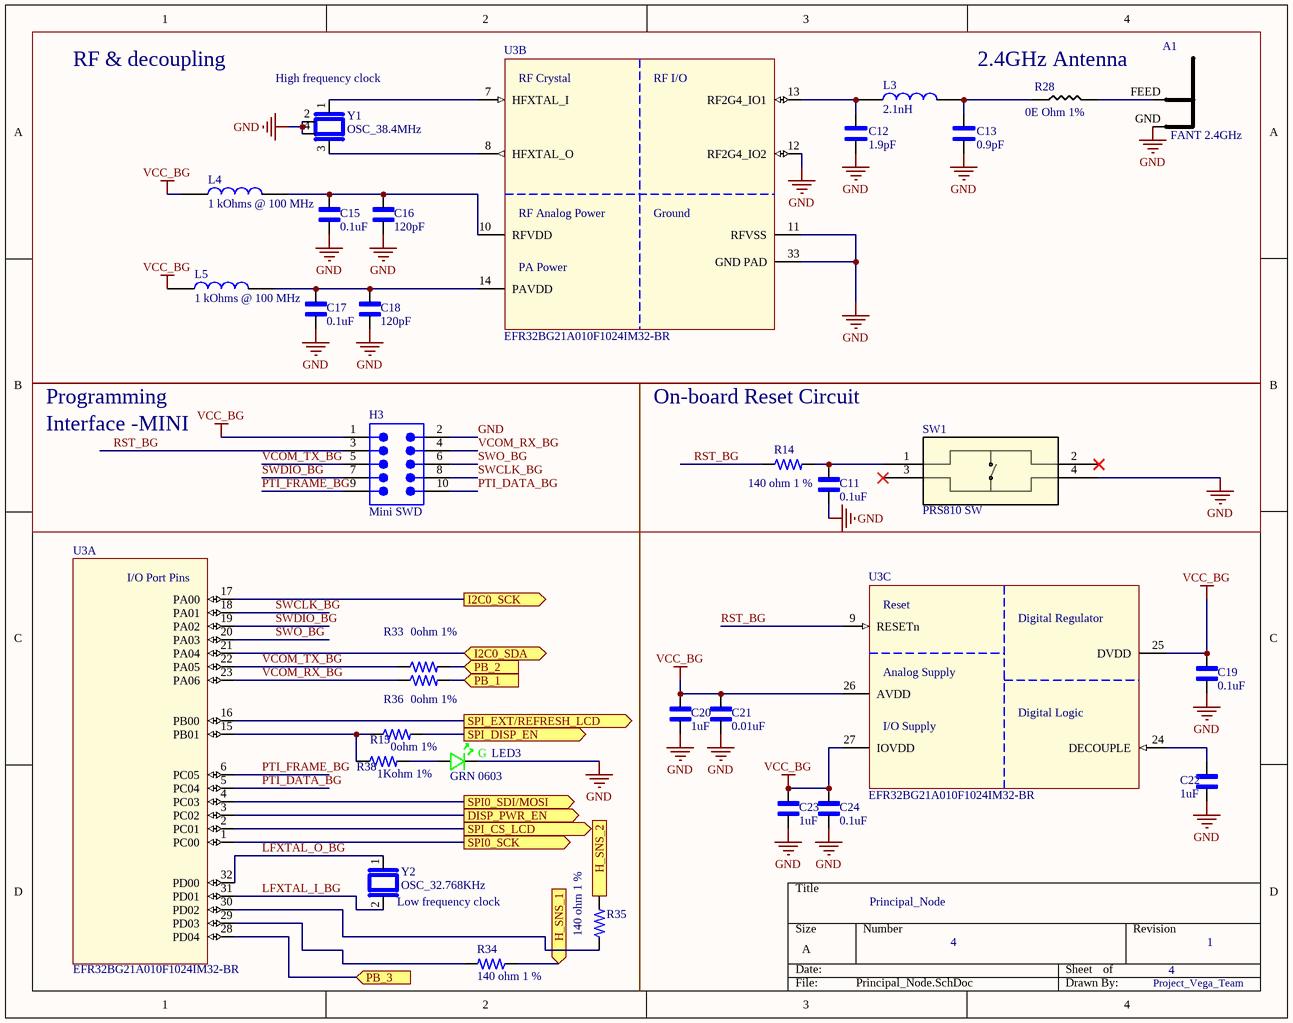
[diagram p3: Principal_Node.SchDoc]

### Parts
A1  FANT 2.4GHz  [FANT_2P4]
C11  0.1uF  [CAPC1608X90]
C12  1.9pF  [0402_Passive_Capacitor]
C13  0.9pF  [0402_Passive_Capacitor]
C15  0.1uF  [CAPC1608X90]
C16  120pF  [CAPC1608X90]
C17  0.1uF  [CAPC1608X90]
C18  120pF  [CAPC1608X90]
C19  0.1uF  [CAPC1608X90]
C20  1uF  [CAPC1608X90]
C21  0.01uF  [CAPC1608X90]
C22  1uF  [CAPC1608X90]
C23  1uF  [CAPC1608X90]
C24  0.1uF  [CAPC1608X90]
H3  Mini SWD  [FTSH-105-01-XXX-DV-K]
L3  2.1nH  [0402_Inductor]
L4  1 kOhms @ 100 MHz  [INDC1608X95N]
L5  1 kOhms @ 100 MHz  [INDC1608X95N]
LED3  GRN 0603  [LED_0603_GRN_WL-SMCW]
R14  140 ohm 1 %  [RES_0603_1608X06]
R15  0ohm 1%  [RES_0603]
R28  0E Ohm 1%  [0402_Passive_Resistor]
R33  0ohm 1%  [RES_0603]
R34  140 ohm 1 %  [RES_0603_1608X06]
R35  140 ohm 1 %  [RES_0603_1608X06]
R36  0ohm 1%  [RES_0603]
R38  1Kohm 1%  [RES_0603]
SW1  PRS810 SW  [PTS810_CNK]
U3  EFR32BG21A010F1024IM32-BR  [QFN32-EFR32xG2xIM32-BR]  (parts A,B,C of 3)  (no BOM)
Y1  OSC_38.4MHz  [OSC_38.4MHz]
Y2  OSC_32.768KHz  [OSC_32.768KHz]

### Ports
DISP_PWR_EN (out, see Input_power[3B]), H_SNS_1 (in, see Input_power[3C]), H_SNS_2 (in, see Input_power[3D]), I2C0_SCK (out, see Project_Node_Sensors[3C]), I2C0_SDA (bidir, see Project_Node_Sensors[2C]), PB_1 (in, see Input_power[2C]), PB_2 (in, see Input_power[2D]), PB_3 (in, see Input_power[2D]), SPI0_SCK (out, see Project_Node_Sensors[1C]), SPI0_SDI/MOSI (out, see Project_Node_Sensors[1C]), SPI_CS_LCD (out, see Project_Node_Sensors[1C]), SPI_DISP_EN (out, see Project_Node_Sensors[1C]), SPI_EXT/REFRESH_LCD (out, see Project_Node_Sensors[1C])

### Nets
GND: A1.GND C11.2 C12.2 C13.2 C15.2 C16.2 C17.2 C18.2 C19.2 C20.2 C21.2 C22.2 C23.2 C24.2 H3.2 LED3.C SW1.4 U3.11(RFVSS) U3.12(RF2G4_IO2) U3.33(GND_PAD) Y1.2 Y1.4
VCC_BG: C19.1 C20.1 C21.1 C23.1 C24.1 H3.1 L4.1 L5.1 U3.25(DVDD) U3.26(AVDD) U3.27(IOVDD)
I2C0_SCK: U3.17(PA00) ; port I2C0_SCK
I2C0_SDA: U3.21(PA04) ; port I2C0_SDA
LFXTAL_I_BG: U3.31(PD01) Y2.2
LFXTAL_O_BG: U3.32(PD00) Y2.1
PTI_DATA_BG: H3.10 U3.5(PC04)
PTI_FRAME_BG: H3.9 U3.6(PC05)
RST_BG: H3.3 R14.1 U3.9(RESETn)
SWCLK_BG: H3.8 U3.18(PA01)
SWDIO_BG: H3.7 U3.19(PA02)
SWO_BG: H3.6 U3.20(PA03)
VCOM_RX_BG: H3.4 R36.1 U3.23(PA06)
VCOM_TX_BG: H3.5 R33.1 U3.22(PA05)
NetA1_FEED: A1.FEED R28.2
NetC11_1: C11.1 R14.2 SW1.1
NetC12_1: C12.1 L3.1 U3.13(RF2G4_IO1)
NetC13_1: C13.1 L3.2 R28.1
NetC15_1: C15.1 C16.1 L4.2 U3.10(RFVDD)
NetC17_1: C17.1 C18.1 L5.2 U3.14(PAVDD)
NetC22_1: C22.1 U3.24(DECOUPLE)
NetC30_2: R15.2 ; port SPI_DISP_EN
NetJ3_3: R34.1 ; port H_SNS_1
NetJ4_3: R35.2 ; port H_SNS_2
NetLED3_A: LED3.A R38.2
NetP1_1: U3.1(PC00) ; port SPI0_SCK
NetP1_2: U3.4(PC03) ; port SPI0_SDI/MOSI
NetP1_3: U3.2(PC01) ; port SPI_CS_LCD
NetP1_4: U3.16(PB00) ; port SPI_EXT/REFRESH_LCD
NetR15_1: R15.1 R38.1 U3.15(PB01)
NetR33_2: R33.2 ; port PB_2
NetR34_2: R34.2 U3.29(PD03)
NetR35_1: R35.1 U3.30(PD02)
NetR36_2: R36.2 ; port PB_1
NetSW4_1: U3.28(PD04) ; port PB_3
NetU1_4: U3.3(PC02) ; port DISP_PWR_EN
NetU3_7: U3.7(HFXTAL_I) Y1.1
NetU3_8: U3.8(HFXTAL_O) Y1.3

Not connected (* = marked no-connect by the designer): SW1 2* 3*

### Notes on the sheet
- RF & decoupling
- (near Y1) High frequency clock
- (near R28) 2.4GHz Antenna
- Programming
- Interface -MINI
- On-board Reset Circuit
- (near Y2) Low frequency clock
- (in symbol EFR32BG21A010F1024IM32-BR, part A) I/O Port Pins
- (in symbol EFR32BG21A010F1024IM32-BR, part B) RF Crystal; RF I/O; RF Analog Power; Ground; PA Power
- (in symbol EFR32BG21A010F1024IM32-BR, part C) Reset; Digital Regulator; Analog Supply; Digital Logic; I/O Supply
- (in symbol LED_green) G

### Library data of the parts
A1 = FANT_2P4: Inverted F antenna
C11 C15-C24 = CC0603KRX7R9BB104: 0.1 ÂµF Â±10% 50V Ceramic Capacitor X7R 0603 (1608 Metric); MF: Yageo; SnapEDA_Link: https://www.snapeda.com/parts/CC0603KRX7R9BB104/Yageo/view-part/?ref=snap; Package: 0603 Yageo; Value: *; MP: CC0603KRX7R9BB104; Check_prices: https://www.snapeda.com/parts/CC0603KRX7R9BB104/Yageo/view-part/?ref=eda
C12 C13 = C_0402: MULTILAYER CERAMIC CAPACITORS MLCC - SMD/SMT 1UF 25V 0402 ROHS; MFR Part #: CL05A105KA5NQNC; Type: Basic; Datasheet: https://datasheet.lcsc.com/szlcsc/Samsung-Electro-Mechanics-CL05A105KA5NQNC_C52923.pdf; LCSC Part#: C52923; Value: 1uF
H3 = Debug Connector Mini SWD - 0.05": Mini SWD 0.05 Pitch Connector - 10 Pin SMT Box Header | Adafruit Industries 4048; Manufacturer Part Number: 4048; Number of Positions: 10; Supplier 1: Digi-Key; Manufacturer: Adafruit Industries; RoHS: No; Category: Connectors; Stock 1: 201; Pricing 1: 1=1.95000 (USD); ComponentLink1URL: https://media.digikey.com/pdf/Data%20Sheets/Adafruit%20PDFs/4048_Web.pdf?src-supplier=Digi-Key; ComponentLink1Description: https://media.digikey.com/pdf/Data%20Sheets/Adafruit%20PDFs/4048_Web.pdf?src-supplier=Digi-Key; Supplier: Digikey; Supplier Part Number: 1528-2827-ND; Stock: 198; Pricing: 1=1.95 (USD); Mounting Technology: Surface Mount; Contact Shape: Square; Contact Finish - Mating: -; Connector Type: Header; Fastening Type: Pull; Series: -; Contact Type: Male Pin; Number of Rows: 2; Termination: Solder; ComponentLink2URL: https://media.digikey.com/pdf/Data%20Sheets/Adafruit%20PDFs/4048_Web.pdf?src-supplier=Digikey; ComponentLink2Description: https://media.digikey.com/pdf/Data%20Sheets/Adafruit%20PDFs/4048_Web.pdf?src-supplier=Digikey
L3 = IND_0402: Inductor Package 0603; MP: LQM18DN100M70L; MF: Murata Electronics; Price: None; SnapEDA_Link: https://www.snapeda.com/parts/LQM18DN100M70L/Murata/view-part/4834755/?ref=snap; Package: 0603 Murata; Availability: Unavailable; Value: *
L4 L5 = LQM18DN100M70L: Inductor with Inductance 10uH Tol.+/-20% Package 0603 (1608); MF: Murata Electronics; MP: LQM18DN100M70L; Price: None; SnapEDA_Link: https://www.snapeda.com/parts/LQM18DN100M70L/Murata/view-part/4834755/?ref=snap; Package: 0603 Murata; Availability: Unavailable; Value: *
LED3 = LED_green: LED, 0603, GREEN, 430MCD, 520NM; Manufacturer: Wurth Electronics; Manufacturer Part Number: 150060GS75000; Dynamic Catalog: 0603 Rectangle with Flat Top Chip LEDs; 3D Model: SMCW_0603.igs / SMCW_0603.stp / SMCW_0603.wrl; Wavelength - Peak: 515nm; Voltage - Forward (Vf) (Typ): 3.2V; Current - Test: 20mA; Viewing Angle: 140°; Lens Type: Clear; Lens Style/Size: Rectangle with Flat Top, 1.1mm x 0.7mm; Other Names: 732-4971-2; Supplier 1: Digi-Key; Stock 1: 34964; Pricing 1: 1=0.14, 50=0.129, 100=0.11, 500=0.095 (USD); Standard Package: 4,000; Category: Optoelectronics; Family: LED Indication - Discrete; Series: WL-SMCW; Packaging: Tape & Reel (TR); Color: Green; Wavelength - Dominant: 520nm; Millicandela Rating: 430mcd; Package / Case: 0603 (1608 Metric); Size / Dimension: 1.60mm L x 0.80mm W; Height: 0.70mm; Mounting Type: Surface Mount; Online Catalog: 0603 Rectangle with Flat Top Chip LEDs; ComponentLink1URL: https://katalog.we-online.de/led/datasheet/150060GS75000.pdf?src-supplier=Digi-Key; ComponentLink1Description: https://katalog.we-online.de/led/datasheet/150060GS75000.pdf?src-supplier=Digi-Key; ComponentLink2URL: http://www.produktinfo.conrad.com/datenblaetter/750000-774999/759427-da-01-en-CHIPLED_0603_W_KL_GRUEN_150060GS75000.pdf?src-supplier=Conrad; ComponentLink2Description: http://www.produktinfo.conrad.com/datenblaetter/750000-774999/759427-da-01-en-CHIPLED_0603_W_KL_GRUEN_150060GS75000.pdf?src-supplier=Conrad; Supplier Part Number 1: 732-4971-1-ND
R14 R34 R35 = RC0603FR-07140RL: SMD Chip Resistor, 140 Ohm, ± 1%, 100 mW, 0603 [1608 Metric], Thick Film, General Purpose; Manufacturer: Yageo; Value: 140R; Power Rating: 100mW; Voltage Rating: 50V; Temperature Coefficient: 100ppm/°C; Supplier: Digikey; Supplier Part Number: 311-140HRCT-ND; Manufacturer Part Number: RC0603FR-07140RL; RoHS: Yes; Category: Chip SMD Resistors; Stock: 238807; Pricing: 1=0.1, 10=0.019, 50=0.0112, 100=0.0093, 500=0.00622, 1000=0.00532, 5000=0.00382, 10000=0.00335, 25000=0.00287, 35000=0.00278, 50000=0.00257, 125000=0.00232 (USD); Mounting Technology: Surface Mount; Case/Package: 0603; Case Code (Imperial): 0603; Case Code (Metric): 1608; Min Operating Temperature: -55°C; Max Operating Temperature: 155°C; Tolerance: 1%; Packaging: Tape and Reel; Termination: SMD/SMT; Voltage Rating (DC): 50V; Features: Moisture Resistant; Series: RC; Max Power Dissipation: 100mW; Number of Terminations: 2; Construction: Rectangular; Technology: THICK FILM; Length: 1.6mm; Height: 0.45mm; Depth: 0.8mm; Lead Free: Lead Free; RoHS Compliant: Yes; Military Standard: Not; ComponentLink1URL: https://datasheet.ciiva.com/11808/0900766b80c66297-11808828.pdf?src-supplier=Rs; ComponentLink1Description: https://datasheet.ciiva.com/11808/0900766b80c66297-11808828.pdf?src-supplier=Rs; ComponentLink2URL: https://datasheet.ciiva.com/15189/getdatasheetpartid-329205-15189606.pdf?src-supplier=Verical; ComponentLink2Description: https://datasheet.ciiva.com/15189/getdatasheetpartid-329205-15189606.pdf?src-supplier=Verical
R15 R33 R36 R38 = RES_0603: as R31 on sheet Power_Sheet; Availability: Unavailable; Package: None; Value: *; Price: None
R28 = R_0Ohm_0402: CHIP RESISTOR - SURFACE MOUNT 0OHMS ±1% 1/16W 0402 ROHS; MFR Part #: 0402WGF0000TCE; Value: 0 Ohm; Datasheet: https://datasheet.lcsc.com/szlcsc/Uniroyal-Elec-0402WGF0000TCE_C17168.pdf; LCSC Part#: C17168; Type: Basic
SW1 = PTS810SJM250SMTRLFS: Switch Tactile N.O. SPST Button J-Bend 0.05A 16V 150000Cycles 1.569N SMD T/R; Manufacturer: ITT C&K; Actuator Color: Grey; Operating Force: 160gf; Current Rating: 50mA; Illumination Type: Non-Illuminated; Switch Travel: 0.15mm; Switch Function: Off-Mom; Number of Positions: 2; Actuator Type: Standard; Contact Resistance: 500mR; Supplier: Digikey; Supplier Part Number: CKN10502CT-ND; Manufacturer Part Number: PTS810SJM250SMTRLFS; RoHS: Yes; Stock: 130228; Pricing: 1=0.49, 10=0.474, 25=0.4568, 100=0.3954, 250=0.36028, 500=0.3339, 1000=0.29876, 2900=0.28294, 5800=0.26185, 14500=0.24428 (USD); Mounting Technology: Surface Mount; Case/Package: SMD/SMT; Pins: 4; Mechanical Life: 150000Cycles; Color: Black; Contact Plating: Silver; Min Operating Temperature: -40°C; Max Operating Temperature: 85°C; Throw Configuration: SPST; Packaging: Tape and Reel; Voltage Rating (DC): 16V; Package Quantity: 2900; Series: PTS810; Termination: J-Bend; Max Current Rating: 50mA; Orientation: Straight; Contact Current Rating: 50mA; Length: 3.2mm; Depth: 4.6mm; RoHS Compliant: Yes; Lead Free: Lead Free; ComponentLink1URL: https://datasheet.ciiva.com/24082/pts810-4mar13-248115-24082262.pdf?src-supplier=Mouser; ComponentLink1Description: https://datasheet.ciiva.com/24082/pts810-4mar13-248115-24082262.pdf?src-supplier=Mouser; ComponentLink2URL: https://datasheet.ciiva.com/18514/pts810-4mar13-18514058.pdf?src-supplier=Digikey; ComponentLink2Description: https://datasheet.ciiva.com/18514/pts810-4mar13-18514058.pdf?src-supplier=Digikey; ComponentLink3URL: https://datasheet.ciiva.com/18514/pts810-4mar13-18514059.pdf?src-supplier=Digikey; ComponentLink3Description: https://datasheet.ciiva.com/18514/pts810-4mar13-18514059.pdf?src-supplier=Digikey; ComponentLink4URL: https://datasheet.ciiva.com/18514/pts810-4mar13-18514060.pdf?src-supplier=Digikey; ComponentLink4Description: https://datasheet.ciiva.com/18514/pts810-4mar13-18514060.pdf?src-supplier=Digikey
U3 = EFR32BG21A010F1024IM32-BR: Blue Gecko, QFN32, 2.4G, 10dB, Bluetooth 5.1, 1024kB, 96kB(RAM), 20 GPIO; Manufacturer: Silicon Labs; Supplier: Digikey; Supplier Part Number: 336-5869-1-ND; Manufacturer Part Number: EFR32BG21A010F1024IM32-BR; RoHS: No; Category: RF Receivers, Transceivers; Stock: 38892; Pricing: 1=4.27, 10=3.816, 25=3.4348, 100=3.1293, 250=2.82404, 500=2.6875 (USD); ComponentLink1URL: https://www.silabs.com/documents/login/data-sheets/efr32bg21-datasheet.pdf?src-supplier=Digikey; ComponentLink1Description: https://www.silabs.com/documents/login/data-sheets/efr32bg21-datasheet.pdf?src-supplier=Digikey; ComponentLink2URL: https://datasheet.octopart.com/EFR32BG21A010F1024IM32-BR-Silicon-Labs-datasheet-142046433.pdf?src-supplier=Arrow.cn; ComponentLink2Description: https://datasheet.octopart.com/EFR32BG21A010F1024IM32-BR-Silicon-Labs-datasheet-142046433.pdf?src-supplier=Arrow.cn
Y1 = OSC_38.4MHz: 38.4 MHz ±10ppm Crystal 10pF 40 Ohms 4-SMD, No Lead; MF: {'manufacturer': u'Murata Electronics'}; MP: XRCGB38M400F2P00R0; Package: None; Price: None; Value: *; Availability: Unavailable; Supplier 1: Digikey; Supplier Part Number 1: 4606-TZ3398BCT-ND
Y2 = OSC_32.768KHz: Tuning Fork Crystal 32.768kHz in 1.2 x 2.0mm package; MF: Micro Crystal; MP: CM8V-T1A-32.768KHZ-7PF-20PPM-TA-QC; Package: SMD-2 Micro Crystal; Price: None; Value: *; SnapEDA_Link: https://www.snapeda.com/parts/CM8V-T1A-32.768KHZ-7PF-20PPM-TA-QC/Micro+Crystal/view-part/?ref=snap; Availability: Not in stock; Check_prices: https://www.snapeda.com/parts/CM8V-T1A-32.768KHZ-7PF-20PPM-TA-QC/Micro+Crystal/view-part/?ref=eda; Supplier 1: Digikey; Supplier Part Number 1: 2195-CM8V-T1A-32.768KHZ-7PF-20PPM-TA-QCCT-ND